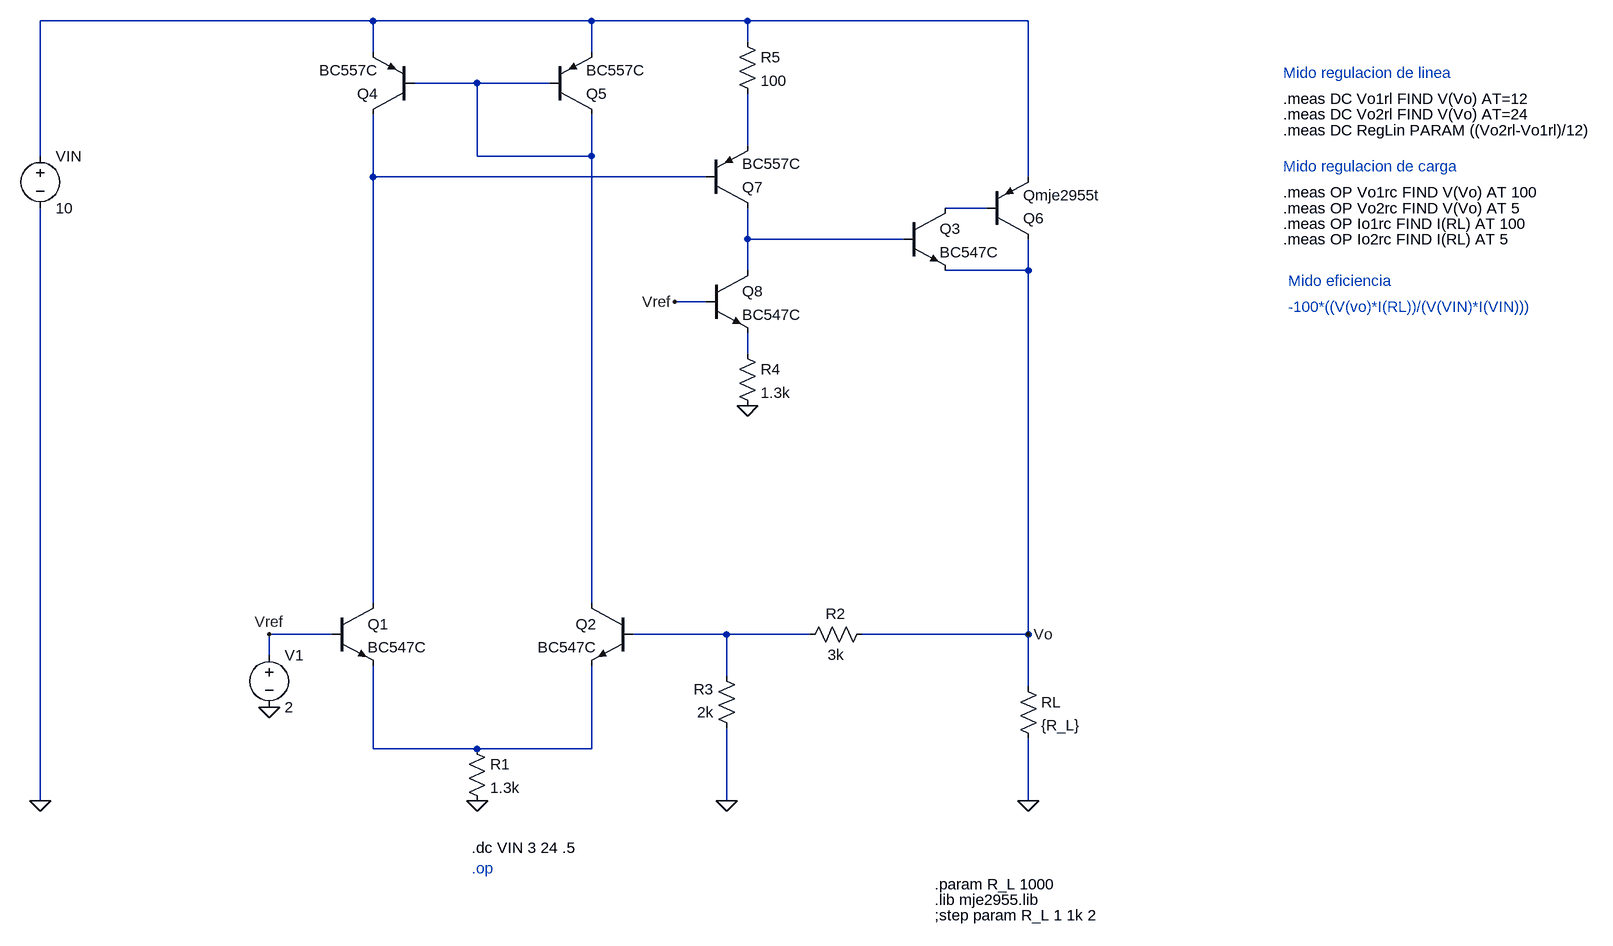
[diagram p0: schematic primer_check_5.asc]
primer_check_5.asc, the LTspice schematic file:
Version 4.1
SHEET 1 1708 1072
WIRE -208 -320 -720 -320
WIRE 128 -320 -208 -320
WIRE 368 -320 128 -320
WIRE 800 -320 368 -320
WIRE 368 -288 368 -320
WIRE -208 -272 -208 -320
WIRE 128 -272 128 -320
WIRE -48 -224 -144 -224
WIRE 64 -224 -48 -224
WIRE 368 -128 368 -208
WIRE -720 -112 -720 -320
WIRE -48 -112 -48 -224
WIRE 128 -112 128 -176
WIRE 128 -112 -48 -112
WIRE -208 -80 -208 -176
WIRE 304 -80 -208 -80
WIRE 800 -80 800 -320
WIRE 736 -32 672 -32
WIRE 368 16 368 -32
WIRE 608 16 368 16
WIRE 368 64 368 16
WIRE 800 64 800 16
WIRE 800 64 672 64
WIRE 304 112 256 112
WIRE 368 192 368 160
WIRE -208 576 -208 -80
WIRE 128 576 128 -112
WIRE -272 624 -368 624
WIRE 336 624 192 624
WIRE 464 624 336 624
WIRE 800 624 800 64
WIRE 800 624 544 624
WIRE -368 656 -368 624
WIRE 336 688 336 624
WIRE 800 704 800 624
WIRE -208 800 -208 672
WIRE -48 800 -208 800
WIRE 128 800 128 672
WIRE 128 800 -48 800
WIRE -720 880 -720 -32
WIRE 336 880 336 768
WIRE 800 880 800 784
FLAG -368 736 0
FLAG -48 880 0
FLAG 800 880 0
FLAG -720 880 0
FLAG 336 880 0
FLAG 800 624 Vo
FLAG 368 272 0
FLAG -368 624 Vref
FLAG 256 112 Vref
SYMBOL npn -272 576 R0
SYMATTR InstName Q1
SYMATTR Value BC547C
SYMBOL npn 192 576 M0
SYMATTR InstName Q2
SYMATTR Value BC547C
SYMBOL npn 608 -32 R0
SYMATTR InstName Q3
SYMATTR Value BC547C
SYMBOL pnp -144 -176 R180
SYMATTR InstName Q4
SYMATTR Value BC557C
SYMBOL pnp 64 -176 M180
SYMATTR InstName Q5
SYMATTR Value BC557C
SYMBOL res -64 784 R0
SYMATTR InstName R1
SYMATTR Value 1.3k
SYMBOL voltage -368 640 R0
WINDOW 123 0 0 Left 0
WINDOW 39 0 0 Left 0
SYMATTR InstName V1
SYMATTR Value 2
SYMBOL voltage -720 -128 R0
WINDOW 123 0 0 Left 0
WINDOW 39 0 0 Left 0
SYMATTR InstName VIN
SYMATTR Value 10
SYMBOL pnp 736 16 M180
SYMATTR InstName Q6
SYMATTR Value Qmje2955t
SYMBOL res 784 688 R0
SYMATTR InstName RL
SYMATTR Value {R_L}
SYMBOL res 560 608 R90
WINDOW 0 0 56 VBottom 2
WINDOW 3 32 56 VTop 2
SYMATTR InstName R2
SYMATTR Value 3k
SYMBOL res 352 784 R180
WINDOW 0 36 76 Left 2
WINDOW 3 36 40 Left 2
SYMATTR InstName R3
SYMATTR Value 2k
SYMBOL pnp 304 -32 M180
SYMATTR InstName Q7
SYMATTR Value BC557C
SYMBOL npn 304 64 R0
SYMATTR InstName Q8
SYMATTR Value BC547C
SYMBOL res 352 176 R0
SYMATTR InstName R4
SYMATTR Value 1.3k
SYMBOL res 352 -304 R0
SYMATTR InstName R5
SYMATTR Value 100
TEXT 656 1008 Left 2 !.param R_L 1000
TEXT 656 1032 Left 2 !.lib mje2955.lib
TEXT -56 952 Left 2 !.dc VIN 3 24 .5
TEXT 656 1056 Left 2 !;step param R_L 1 1k 2
TEXT -56 984 Left 2 ;.op
TEXT 1192 -240 Left 2 ;Mido regulacion de linea
TEXT 1192 -200 Left 2 !.meas DC Vo1rl FIND V(Vo) AT=12
TEXT 1192 -176 Left 2 !.meas DC Vo2rl FIND V(Vo) AT=24
TEXT 1192 -152 Left 2 !.meas DC RegLin PARAM ((Vo2rl-Vo1rl)/12)
TEXT 1192 -96 Left 2 ;Mido regulacion de carga
TEXT 1192 -56 Left 2 !.meas OP Vo1rc FIND V(Vo) AT 100
TEXT 1192 -32 Left 2 !.meas OP Vo2rc FIND V(Vo) AT 5
TEXT 1192 -8 Left 2 !.meas OP Io1rc FIND I(RL) AT 100
TEXT 1192 16 Left 2 !.meas OP Io2rc FIND I(RL) AT 5
TEXT 1200 80 Left 2 ;Mido eficiencia
TEXT 1200 120 Left 2 ;-100*((V(vo)*I(RL))/(V(VIN)*I(VIN)))

The netlist it stands for:
* primer_check_5.asc
Q1 N004 Vref N009 0 BC547C
Q2 N002 N008 N009 0 BC547C
Q3 N005 N006 Vo 0 BC547C
Q4 N004 N002 N001 0 BC557C
Q5 N002 N002 N001 0 BC557C
R1 N009 0 1.3k
V1 Vref 0 2
VIN N001 0 10
Q6 Vo N005 N001 0 Qmje2955t
RL Vo 0 {R_L}
R2 Vo N008 3k
R3 0 N008 2k
Q7 N006 N004 N003 0 BC557C
Q8 N006 Vref N007 0 BC547C
R4 N007 0 1.3k
R5 N001 N003 100
.model NPN NPN
.model PNP PNP
.lib standard.bjt
.param R_L 1000
.lib mje2955.lib
.dc VIN 3 24 .5
;step param R_L 1 1k 2
* .op
* Mido regulacion de linea
.meas DC Vo1rl FIND V(Vo) AT=12
.meas DC Vo2rl FIND V(Vo) AT=24
.meas DC RegLin PARAM ((Vo2rl-Vo1rl)/12)
* Mido regulacion de carga
.meas OP Vo1rc FIND V(Vo) AT 100
.meas OP Vo2rc FIND V(Vo) AT 5
.meas OP Io1rc FIND I(RL) AT 100
.meas OP Io2rc FIND I(RL) AT 5
* Mido eficiencia
* -100*((V(vo)*I(RL))/(V(VIN)*I(VIN)))
.backanno
.end